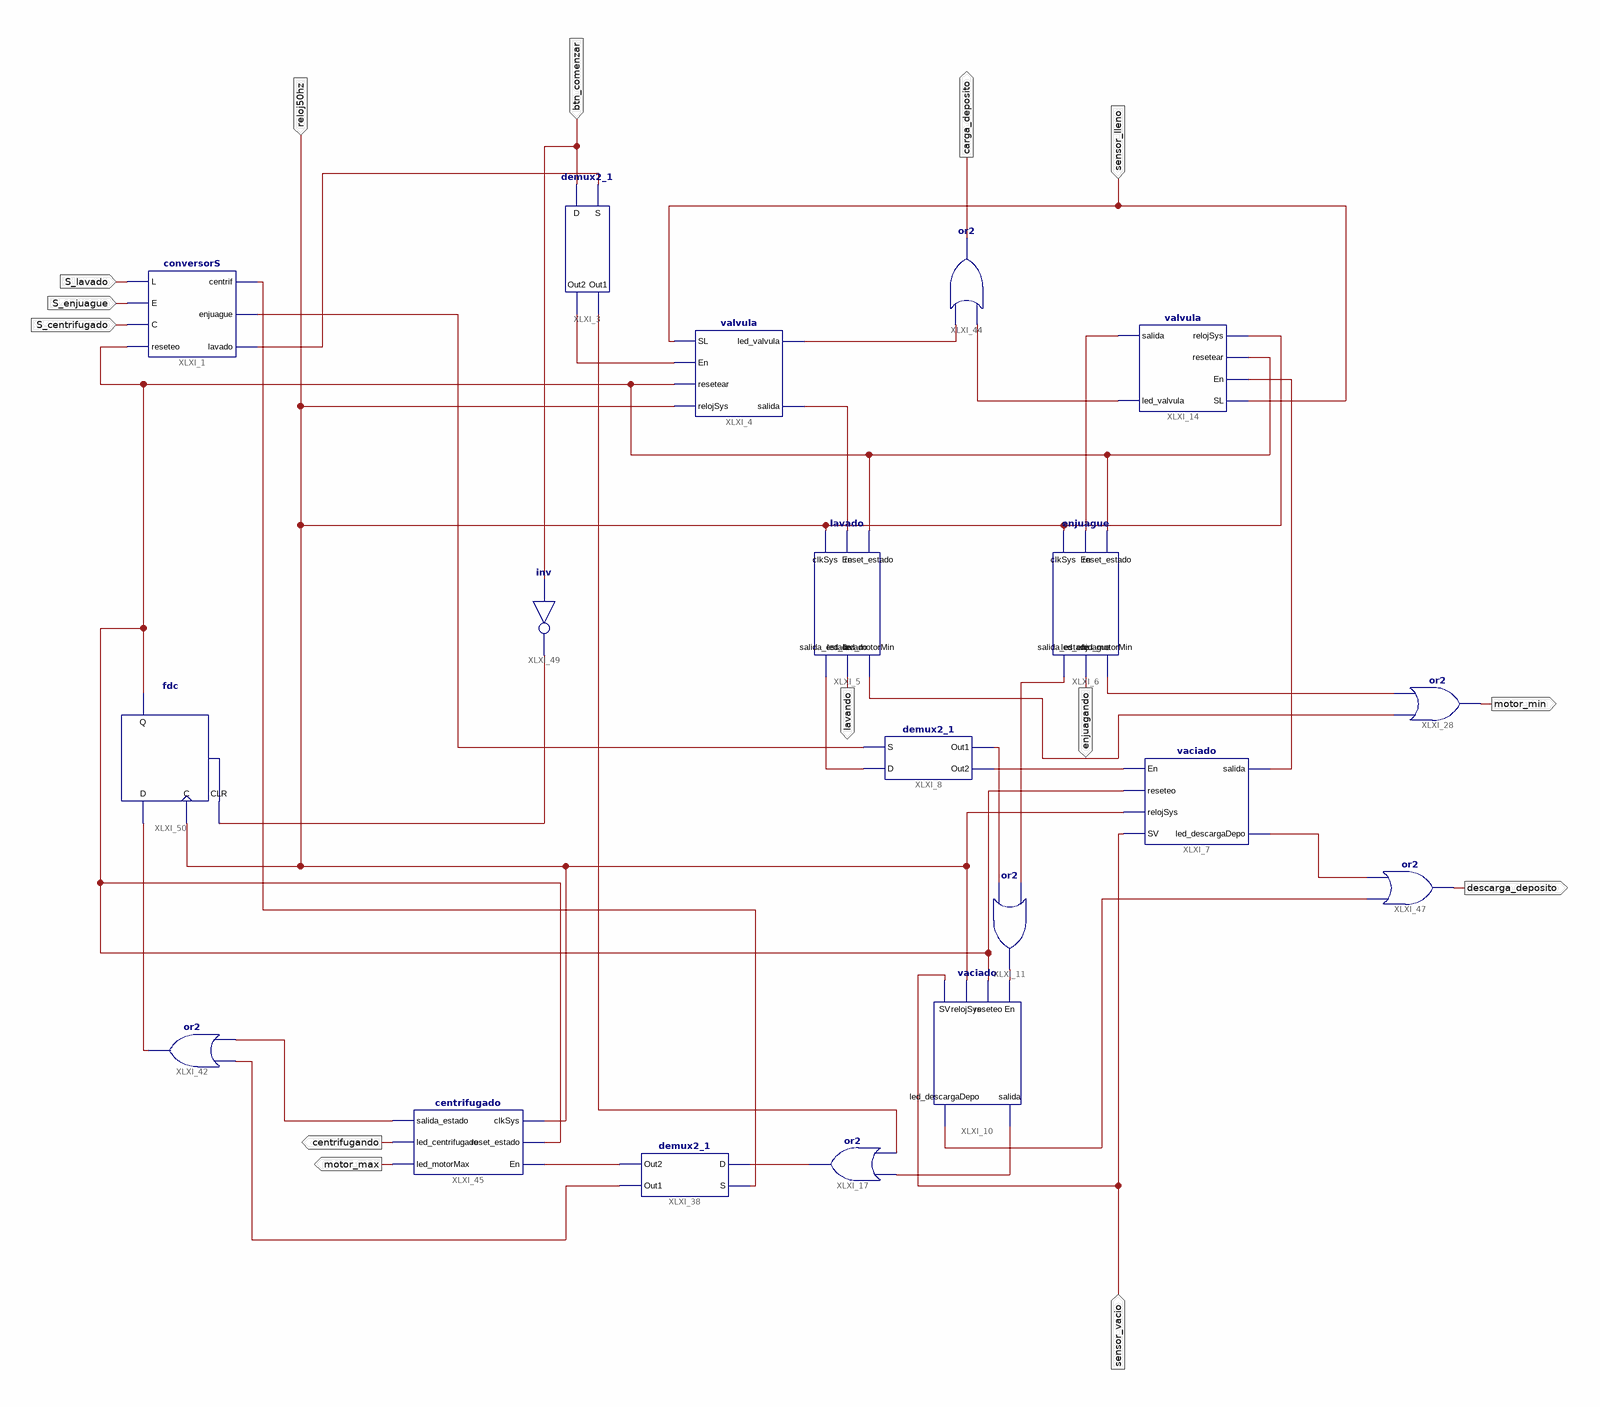
[diagram p0: schematic sheet 1]
// Xilinx ISE schematic lavarropas.sch (spartan3e) as structural Verilog: 19 symbols, 14 ports
module lavarropas (
  input  S_lavado,
  input  S_enjuague,
  input  S_centrifugado,
  input  btn_comenzar,
  input  sensor_lleno,
  input  sensor_vacio,
  input  reloj50hz,
  output motor_max,
  output centrifugando,
  output lavando,
  output enjuagando,
  output motor_min,
  output carga_deposito,
  output descarga_deposito
);

  wire debug, error, XLXN_4, XLXN_12, XLXN_16, XLXN_18, XLXN_19, XLXN_22, XLXN_23, XLXN_25, XLXN_33, XLXN_34,
       XLXN_53, XLXN_54, XLXN_56, XLXN_57, XLXN_82, XLXN_84, XLXN_90, XLXN_96, XLXN_99, XLXN_101, XLXN_110,
       XLXN_112, XLXN_115, XLXN_122, XLXN_137;

  conversorS XLXI_1 (
    .L(S_lavado), .E(S_enjuague), .C(S_centrifugado), .reseteo(error), .centrif(XLXN_122),
    .enjuague(XLXN_90), .lavado(XLXN_4));
  demux2_1 XLXI_3 (.S(XLXN_4), .D(btn_comenzar), .Out1(XLXN_34), .Out2(debug));
  valvula XLXI_4 (
    .SL(sensor_lleno), .En(debug), .resetear(error), .relojSys(reloj50hz), .led_valvula(XLXN_115),
    .salida(XLXN_12));
  lavado XLXI_5 (
    .reset_estado(error), .En(XLXN_12), .clkSys(reloj50hz), .led_motorMin(XLXN_57), .led_lavado(lavando),
    .salida_estado(XLXN_16));
  enjuague XLXI_6 (
    .reset_estado(error), .En(XLXN_23), .clkSys(reloj50hz), .led_motorMin(XLXN_56),
    .led_enjuague(enjuagando), .salida_estado(XLXN_25));
  vaciado XLXI_7 (
    .En(XLXN_18), .reseteo(error), .relojSys(reloj50hz), .SV(sensor_vacio), .salida(XLXN_101),
    .led_descargaDepo(XLXN_54));
  demux2_1 XLXI_8 (.S(XLXN_90), .D(XLXN_16), .Out1(XLXN_22), .Out2(XLXN_18));
  vaciado XLXI_10 (
    .En(XLXN_19), .reseteo(error), .relojSys(reloj50hz), .SV(sensor_vacio), .salida(XLXN_33),
    .led_descargaDepo(XLXN_53));
  or XLXI_11 (XLXN_19, XLXN_22, XLXN_25);
  valvula XLXI_14 (
    .SL(sensor_lleno), .En(XLXN_101), .resetear(error), .relojSys(reloj50hz), .led_valvula(XLXN_99),
    .salida(XLXN_23));
  or XLXI_17 (XLXN_82, XLXN_34, XLXN_33);
  or XLXI_28 (motor_min, XLXN_57, XLXN_56);
  demux2_1 XLXI_38 (.S(XLXN_122), .D(XLXN_82), .Out1(XLXN_84), .Out2(XLXN_137));
  or XLXI_42 (XLXN_110, XLXN_84, XLXN_96);
  or XLXI_44 (carga_deposito, XLXN_99, XLXN_115);
  centrifugado XLXI_45 (
    .En(XLXN_137), .reset_estado(error), .clkSys(reloj50hz), .led_motorMax(motor_max),
    .led_centrifugado(centrifugando), .salida_estado(XLXN_96));
  or XLXI_47 (descarga_deposito, XLXN_53, XLXN_54);
  not XLXI_49 (XLXN_112, btn_comenzar);
  fdc XLXI_50 (.C(reloj50hz), .CLR(XLXN_112), .D(XLXN_110), .Q(error));
endmodule
